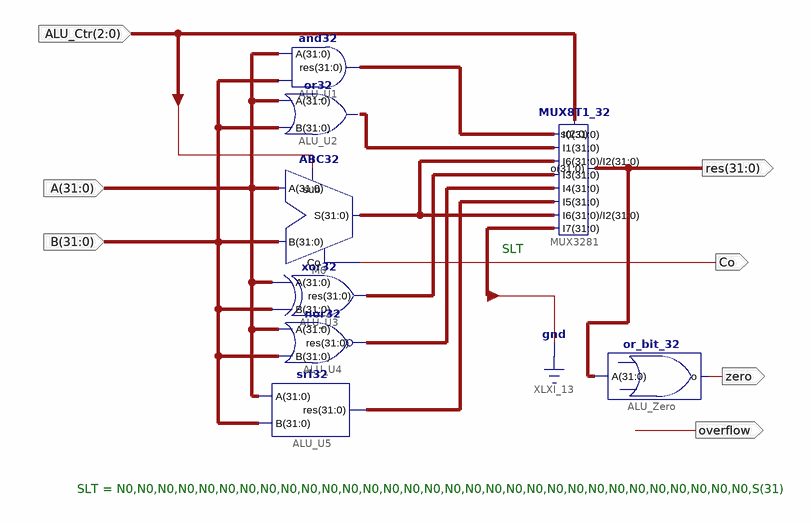
[diagram p0: schematic sheet 1]
// Xilinx ISE schematic alu.sch (kintex7) as structural Verilog: 8 symbols, 7 ports
module alu (
  input  [31:0] A,
  input  [31:0] B,
  input  [2:0] ALU_Ctr,
  output [31:0] res,
  output zero,
  output overflow,
  output Co
);

  wire [31:0] S, XLXN_11, XLXN_12, XLXN_22, XLXN_23, XLXN_47;

  nor32 ALU_U4 (.res(XLXN_11), .A(A), .B(B));
  or32 ALU_U2 (.res(XLXN_23), .A(A), .B(B));
  and32 ALU_U1 (.res(XLXN_22), .A(A), .B(B));
  xor32 ALU_U3 (.A(A), .B(B), .res(XLXN_12));
  srl32 ALU_U5 (.A(A), .B(B), .res(XLXN_47));
  or_bit_32 ALU_Zero (.o(zero), .A(res));
  MUX8T1_32 MUX3281 (
    .s(ALU_Ctr), .I7({{31{1'b0}}, S[31]}), .I6(S), .I5(XLXN_47), .I4(XLXN_11), .I3(XLXN_12), .I2(S),
    .I1(XLXN_23), .I0(XLXN_22), .o(res));
  ABC32 M0 (.B(B), .A(A), .sub(ALU_Ctr[2]), .S(S), .Co(Co));

  // Notes on the sheet:
  //   SLT
  //   SLT = N0,N0,N0,N0,N0,N0,N0,N0,N0,N0,N0,N0,N0,N0,N0,N0,N0,N0,N0,N0,N0,N0,N0,N0,N0,N0,N0,N0,N0,N0,N0,S(31)
endmodule
